# EAGLE design t10_programmin_adapter (EAGLE 6.1)
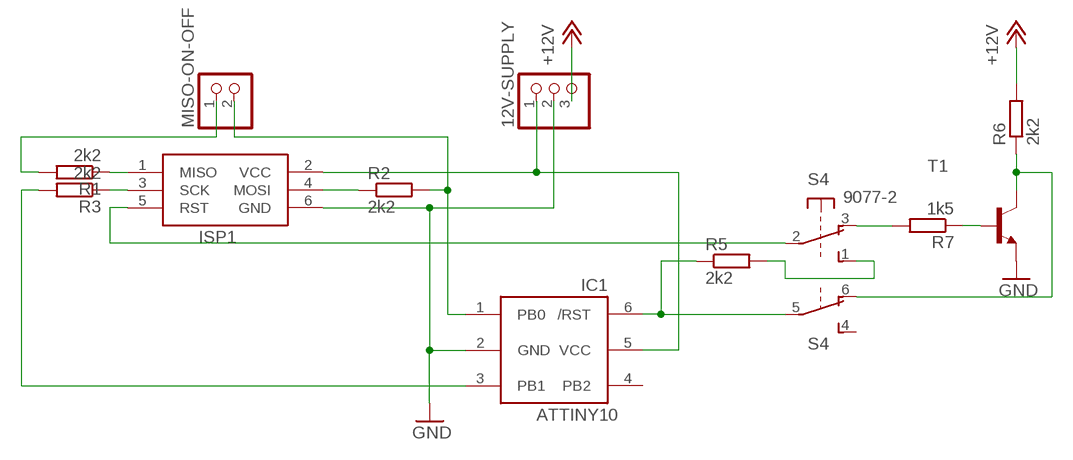
[diagram p0: schematic, sheet 1]

## Parts
12V-SUPPLY  PINHD-1X3/90  [1X03/90]
IC1  ATTINY10  [SOT23-6]
ISP1  AVRISP-6  [AVRISP]
MISO-ON-OFF  PINHD-1X2  [1X02]
R1  2k2  R-EU_0204/7  [0204/7]
R2  2k2  R-EU_0204/7  [0204/7]
R3  2k2  R-EU_0204/7  [0204/7]
R5  2k2  R-EU_0204/7  [0204/7]
R6  2k2  R-EU_0204/7  [0204/7]
R7  1k5  R-EU_0207/2V  [0207/2V]
S4  9077-2  [9077-2]
T1  2N6517-NPN-TO92-CBE  [TO92-CBE]

## Nets
+12V: 12V-SUPPLY.3 R6.2
GND: 12V-SUPPLY.2 IC1.2(GND) ISP1.6(GND) T1.E
ISP-MISO: ISP1.1(MISO) R1.1
ISP-MOSI: ISP1.4(MOSI) R2.1
ISP-RST: ISP1.5(RST) S4.2(1:P)
ISP-SCK: ISP1.3(SCK) R3.1
MISO: MISO-ON-OFF.1 R1.2
N$1: R6.1 S4.6(2:O) T1.C
N$2: R7.1 T1.B
N$3: R7.2 S4.3(1:O)
N$4: R5.2 S4.1(1:S)
RST: IC1.6(/RST) R5.1 S4.5(2:P)
SCK: IC1.3(PB1) R3.2
TDIDATA: IC1.1(PB0) MISO-ON-OFF.2 R2.2
VCC: 12V-SUPPLY.1 IC1.5(VCC) ISP1.2(VCC)
Unconnected: IC1.4(PB2) S4.4(2:S)

## Library data of the parts
12V-SUPPLY = pinhead:PINHD-1X3: PIN HEADER
IC1 = adafruit:ATTINY10: ATtiny4/5/9/10 8-bit Microcontroller with 512/1024 Bytes In-System Programmable Flash
ISP1 = adafruit:AVRISP: AVR ISP HEADER Standard 6 pin header for AVR programming
MISO-ON-OFF = pinhead:PINHD-1X2: PIN HEADER
R1-R3 R5-R7 = rcl:R-EU_: RESISTOR, European symbol
S4 = switch-misc:9077-2: MARQUARDT SWITCH 9077.0200 Distributor: Buerklin <https://www.buerklin.com/default.asp?event=ShowArtikel%2812G2822%29&l=d&jump=ArtNr_12G2822>
T1 = transistor:*-NPN-: NPN Transistror BF959 corrected 2008.03.06

## Board
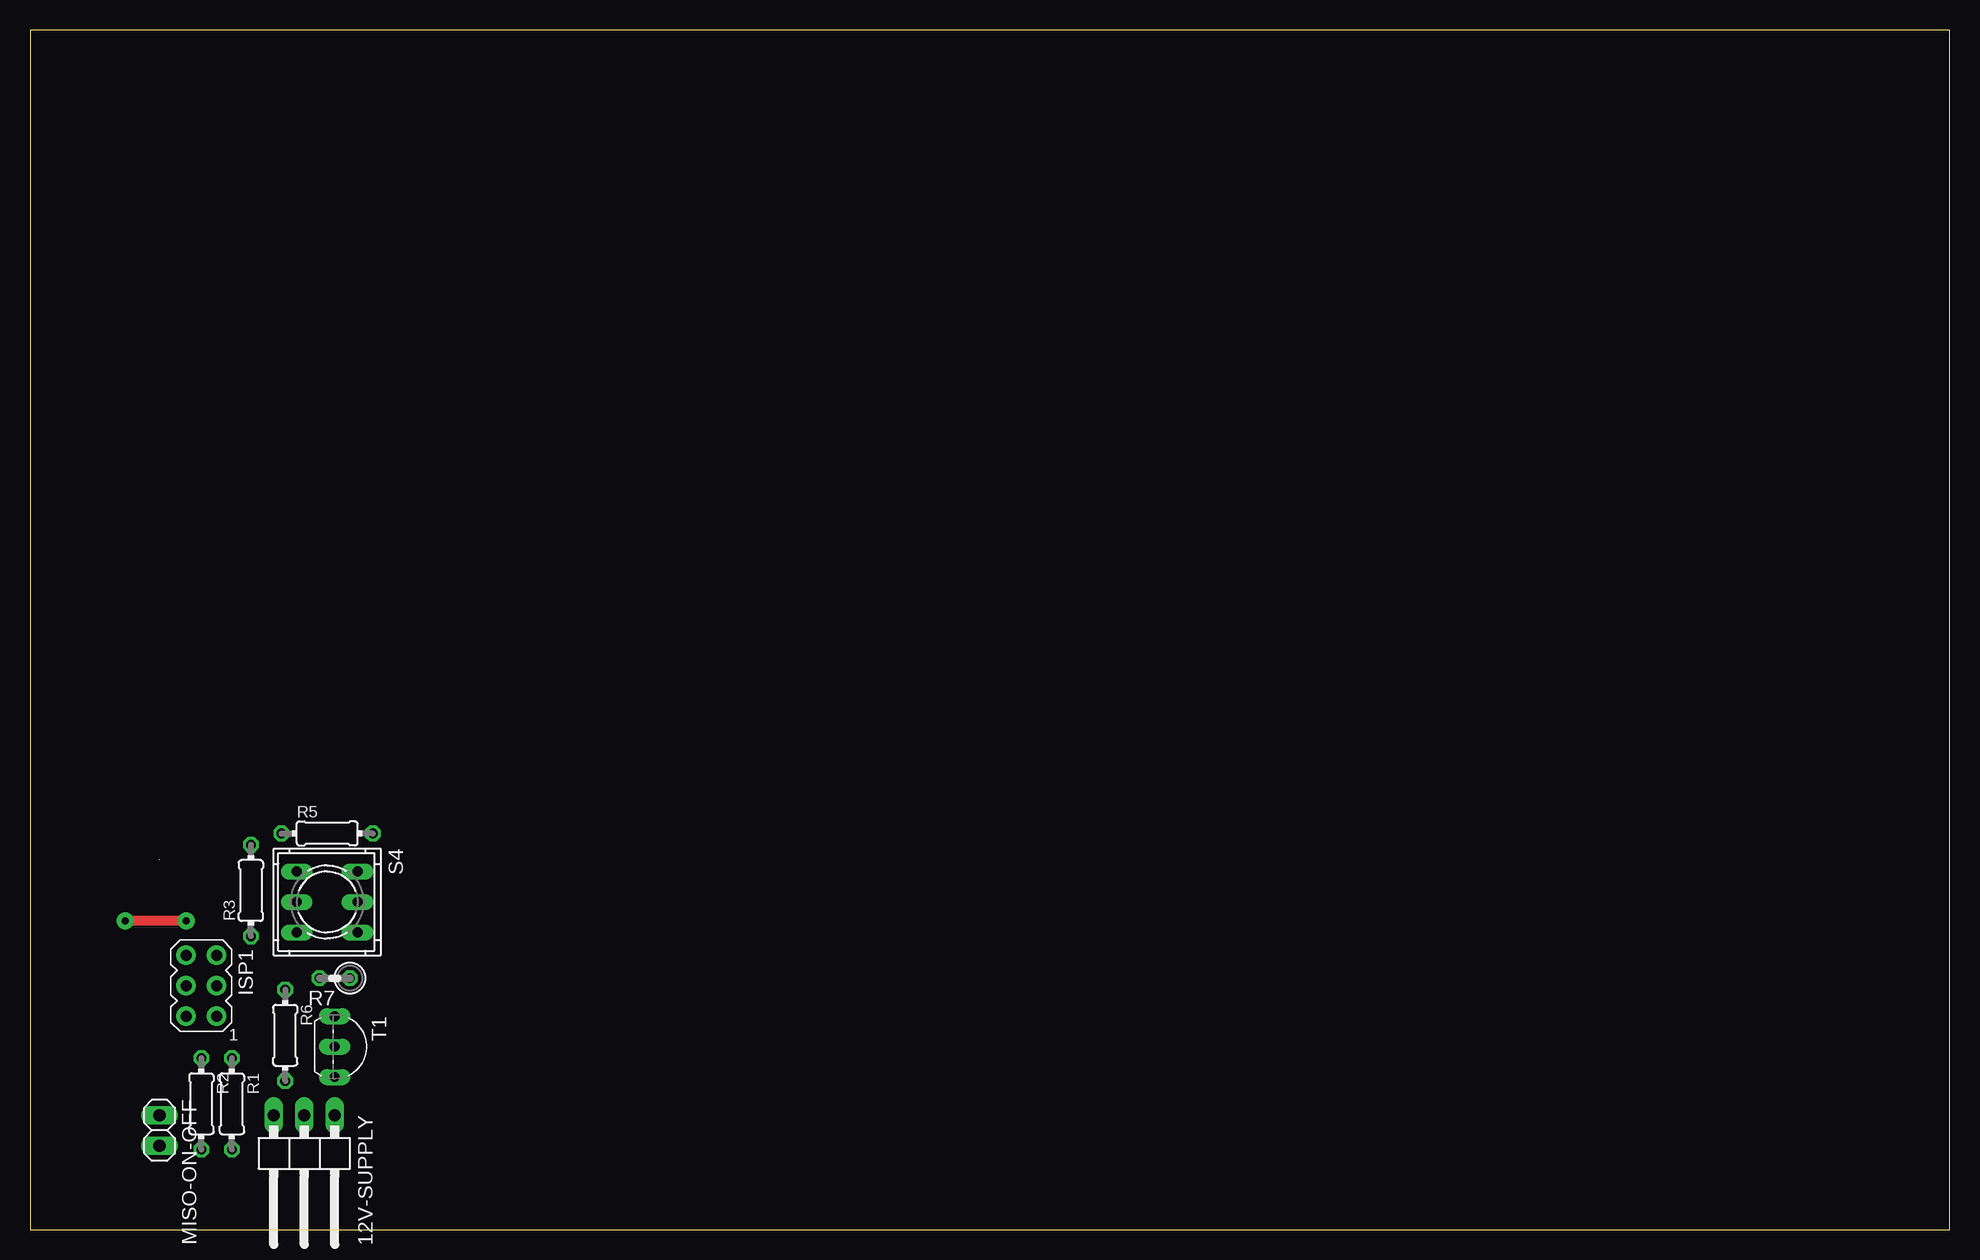
[diagram p1: board, top side]
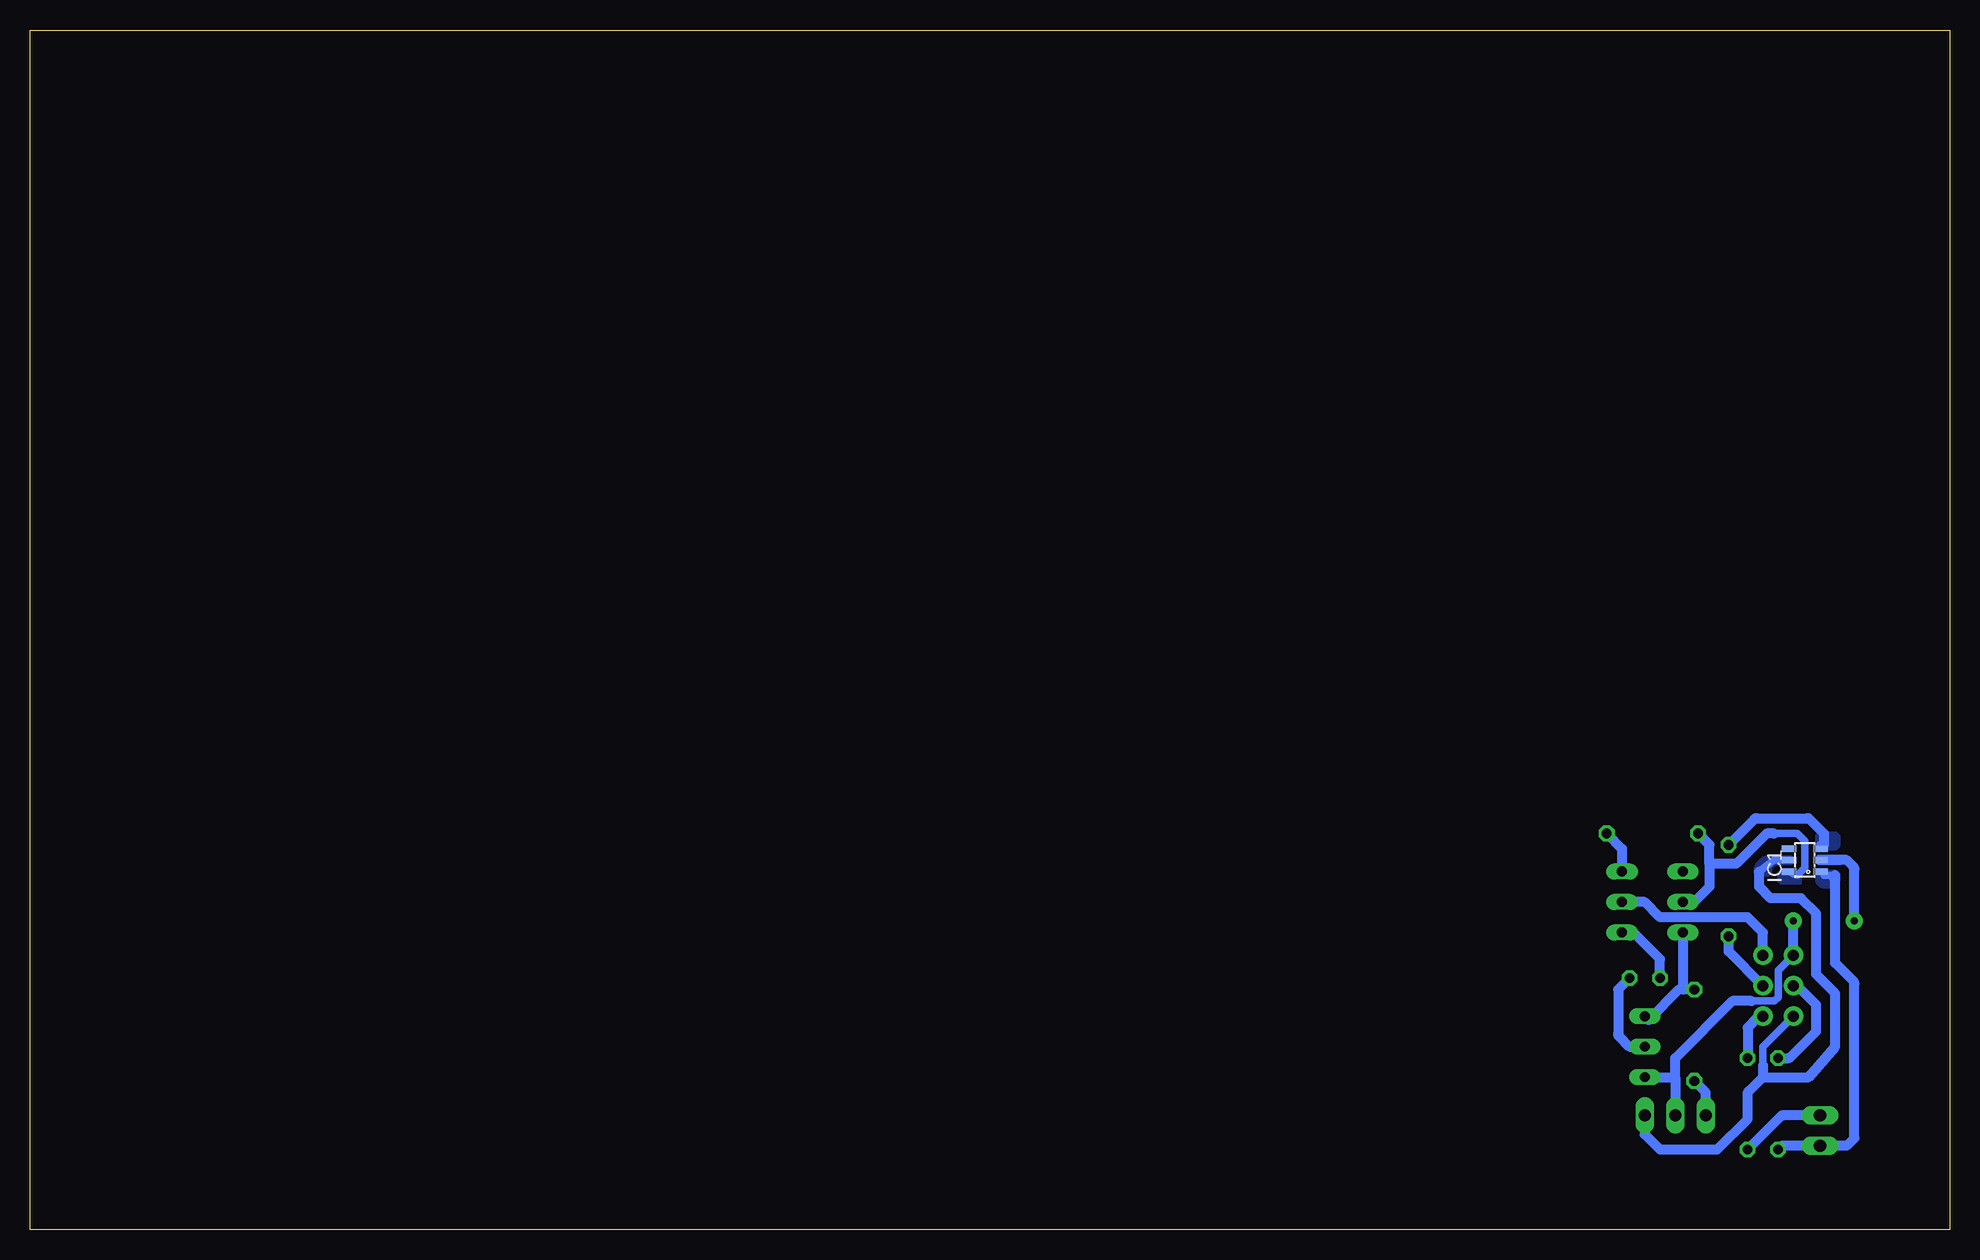
[diagram p2: board, bottom side, seen from below]

Size 160 x 100 mm. Coordinates in mm from the lower left corner, seen from the top.
Outline: 0,0 160,0 160,100 0,100 0,0
Copper layers (1*16): Top 0.035mm / dielectric 1.5mm / Bottom 0.035mm
Design rules: minimum track width 10mil, minimum drill 24mil, track to track 8mil, track to pad 8mil, pad to pad 8mil, via to via 8mil, smd to smd 8mil, copper to edge 40mil, drill to drill 8mil, minimum pad ring 10mil, minimum via ring 8mil, stop-mask expansion 4mil, vias tented up to drill 0mil, thermal gap 10mil

### Footprints (pad centres in the part's own frame; a part is rotated, then mirrored left to right if it is on the bottom)
1X03/90 = drill 1.016 long: 1 -2.54,-3.81; 2 0,-3.81; 3 2.54,-3.81
SOT23-6 = smd 0.55 x 1.2: 1 -0.95,-1.3; 2 0,-1.3; 3 0.95,-1.3; 4 0.95,1.3; 5 0,1.3; 6 -0.95,1.3
AVRISP = drill 0.9 pad 1.626: 1 -1.27,2.54; 2 1.27,2.54; 3 -1.27,0; 4 1.27,0; 5 -1.27,-2.54; 6 1.27,-2.54
1X02 = drill 1.016 long: 1 -1.27,0; 2 1.27,0
0204/7 = drill 0.813 octagon: 1 -3.81,0; 2 3.81,0
0207/2V = drill 0.813 octagon: 1 -1.27,0; 2 1.27,0
9077-2 = drill 0.813 long: 1 -2.54,2.54; 2 0,2.54; 3 2.54,2.54; 4 -2.54,-2.54; 5 0,-2.54; 6 2.54,-2.54
TO92-CBE = drill 0.813 long: B 0,0; C -2.54,0; E 2.54,0

### Placement (x,y rotation side)
12V-SUPPLY  22.86,5.71 180 top
IC1  12.06,30.8 90 bottom
ISP1  14.29,20.32 180 top
MISO-ON-OFF  10.79,8.26 270 top
R1  16.83,10.48 270 top
R2  14.29,10.48 270 top
R3  18.41,28.26 90 top
R5  24.77,33.02 0 top
R6  21.27,16.19 270 top
R7  25.4,20.95 180 top
S4  24.77,27.3 270 top
T1  25.4,15.24 270 top

### Tracks (layer width: path | path; a pad name or v marks a point on that pad's centre or on a via)
+12V
  Bottom 0.813: 12V-SUPPLY.3 20.32,11.43 R6.2
GND  (via drill 0.6 pad 1.42)  (1 unrouted)
  Top 0.813: v13.02,25.72 v7.94,25.72
  Bottom 0.61: ISP1.6 14.29,21.59 14.29,19.37 14.61,19.05 16.51,19.05
  Bottom 0.813: 22.86,12.7 22.86,14.29 18.1,19.05 16.51,19.05 | ISP1.6 v13.02,25.72 | T1.E 22.86,12.7 | v7.94,25.72 7.94,30.03 arc-45 8.03,30.25 8.57,30.8 9.21,30.8 | 22.86,12.7 12V-SUPPLY.2
  Bottom 0.889: 9.21,30.8 10.79,30.8
ISP-MISO
  Bottom 0.813: ISP1.1 15.74,17.78 arc-45 15.97,17.69 16.83,16.83 R1.1
ISP-MOSI
  Bottom 0.813: ISP1.4 12.7,20.32 11.11,18.73 11.11,16.51 13.24,14.38 arc45 13.47,14.29 R2.1
ISP-RST
  Bottom 0.813: ISP1.5 15.56,24.77 16.83,26.04 24.13,26.04 25.4,27.3 S4.2
ISP-SCK
  Bottom 0.813: ISP1.3 18.41,23.18 R3.1
MISO
  Bottom 0.813: MISO-ON-OFF.1 13.84,9.53 arc-45 14.06,9.43 R1.2
N$1
  Bottom 0.813: T1.C 25.08,17.46 22.54,20 22.23,20 | R6.1 22.23,20 | S4.6 22.23,20
N$2
  Bottom 0.813: R7.1 27.62,20 27.62,16.32 arc-45 27.53,16.1 26.67,15.24 T1.B
N$3
  Bottom 0.813: R7.2 24.13,22.54 26.35,24.77 S4.3
N$4
  Bottom 0.813: R5.2 27.3,31.75 S4.1
RST
  Bottom 0.406: 12.7,29.53 12.91,29.53 arc45 13.14,29.62 IC1.6
  Bottom 0.61: 14.61,33.02 12.7,33.02 12.06,32.38 12.06,30.16 12.7,29.53
  Bottom 0.813: 14.61,33.02 15.24,33.02 17.78,30.48 20,30.48 | 20,30.48 20,28.57 21.27,27.3 S4.5 | 20,30.48 20,32.07 R5.1
  pour Bottom (no thermals): 14.29,29.53 14.29,29.21 arc-90 13.97,28.89 12.38,28.89 12.38,29.84 arc90 12.7,29.84 13.97,29.84 arc-90
SCK
  Bottom 0.61: 10.48,32.07 10.79,32.07
  Bottom 0.813: R3.2 16.29,34.2 arc45 16.06,34.29 11.88,34.29 arc45 11.65,34.2 10.48,33.02 10.48,32.07
  pour Bottom (no thermals): 10.79,31.75 9.53,31.75 arc-90 9.21,32.07 9.21,32.7 arc-90 9.53,33.02 10.79,33.02 arc-90 11.11,32.7 11.11,32.07 arc-90
TDIDATA
  Bottom 0.406: 10.44,29.53 arc45 10.5,29.55 10.79,29.84
  Bottom 0.61: 9.53,28.76 arc-45 9.62,28.98 9.84,29.53 10.44,29.53
  Bottom 0.813: 9.53,29.53 9.53,28.76 9.53,22.23 8.03,20.73 arc45 7.94,20.51 7.94,7.62 8.57,6.99 MISO-ON-OFF.2 13.84,6.99 arc-45 14.06,6.89 R2.2
  pour Bottom (no thermals): 11.11,29.84 11.11,29.21 arc-90 10.48,28.57 9.84,28.57 arc-90 9.21,29.21 9.21,29.53 arc-90 9.53,29.84
VCC
  Bottom 0.61: ISP1.2 15.56,15.24 15.56,13.65 | 15.88,29.84 14.61,30.8 IC1.5
  Bottom 0.813: 12V-SUPPLY.1 25.4,7.94 24.13,6.67 19.5,6.67 arc-45 19.27,6.76 16.83,9.21 16.83,11.3 arc45 16.73,11.52 15.56,12.7 | 15.56,13.65 15.56,12.7 | 15.56,12.7 11.75,12.7 9.53,15.24 9.53,19.68 11.11,21.27 11.11,26.35 12.38,27.62 14.92,27.62 15.88,28.57 15.88,29.84
  pour Bottom (no thermals): 13.02,30.8 arc90 13.34,30.48 14.29,30.48 arc-90 14.92,29.84 arc90 15.24,29.53 15.88,29.53 arc90 16.19,29.84 arc90 14.92,31.11 13.34,31.11 arc90